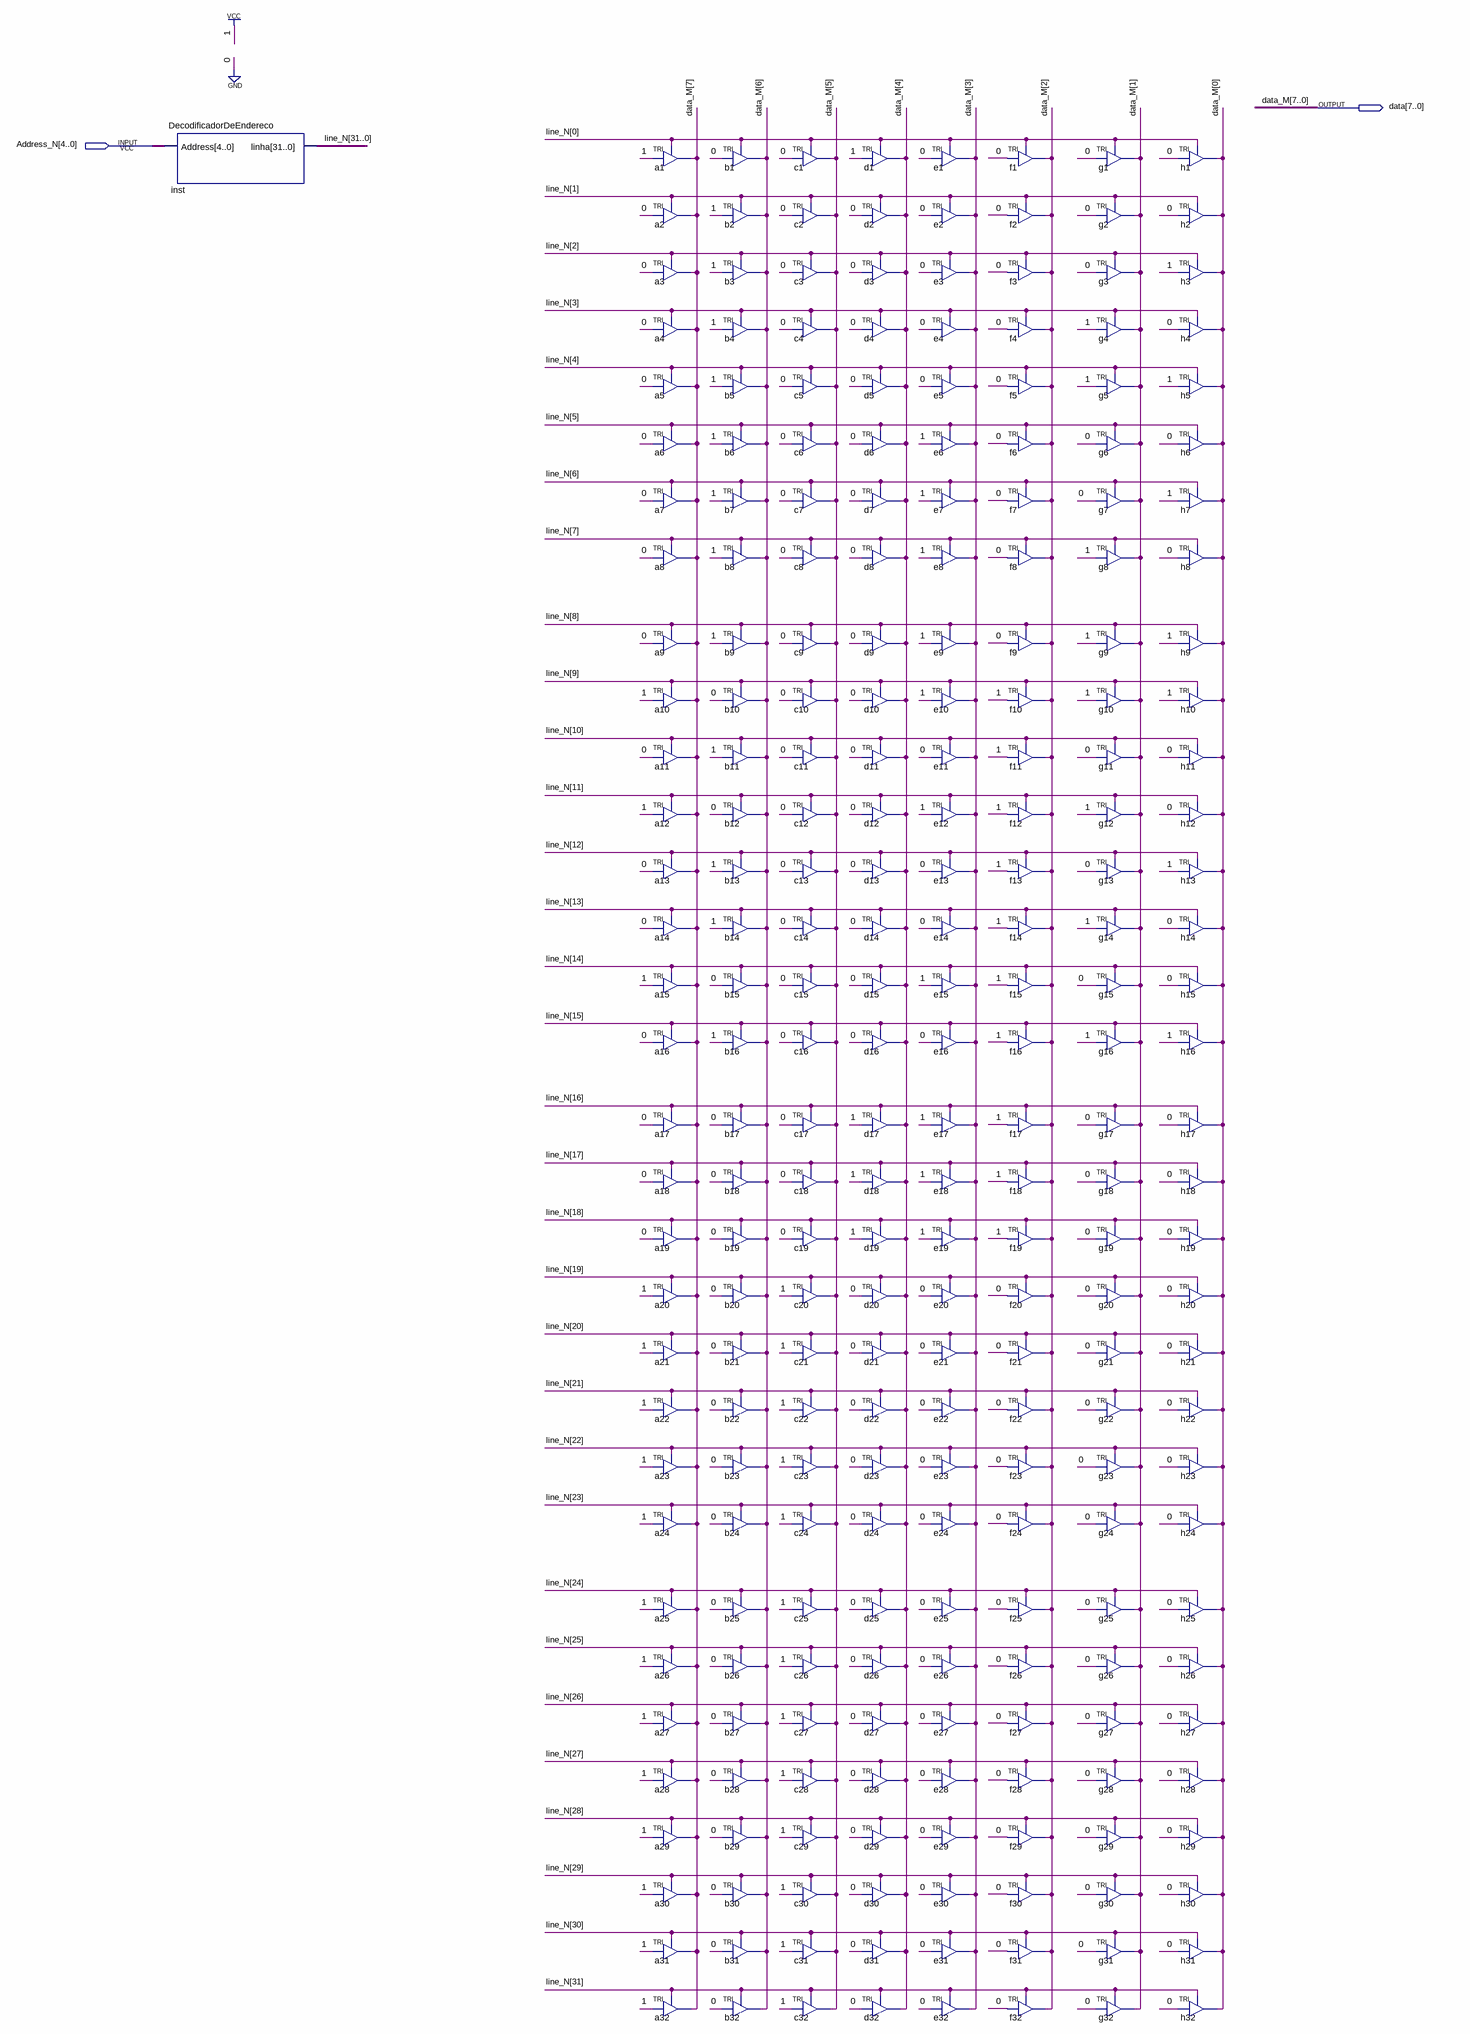
[diagram p0: schematic sheet]
// Quartus schematic PreparacaoProgramaFEEC.bdf as structural Verilog: 257 symbols, 2 pins
module PreparacaoProgramaFEEC (
  input  [4:0] Address_N,
  output [7:0] data
);

  wire [31:0] line_N;

  DecodificadorDeEndereco inst (.Address(Address_N), .linha(line_N));
  TRI a1 (.IN(1'b1), .OE(line_N[0]), .OUT(data[7]));
  TRI a2 (.IN(1'b0), .OE(line_N[1]), .OUT(data[7]));
  TRI a3 (.IN(1'b0), .OE(line_N[2]), .OUT(data[7]));
  TRI a4 (.IN(1'b0), .OE(line_N[3]), .OUT(data[7]));
  TRI a5 (.IN(1'b0), .OE(line_N[4]), .OUT(data[7]));
  TRI a6 (.IN(1'b0), .OE(line_N[5]), .OUT(data[7]));
  TRI a7 (.IN(1'b0), .OE(line_N[6]), .OUT(data[7]));
  TRI a8 (.IN(1'b0), .OE(line_N[7]), .OUT(data[7]));
  TRI a9 (.IN(1'b0), .OE(line_N[8]), .OUT(data[7]));
  TRI a10 (.IN(1'b1), .OE(line_N[9]), .OUT(data[7]));
  TRI a11 (.IN(1'b0), .OE(line_N[10]), .OUT(data[7]));
  TRI a12 (.IN(1'b1), .OE(line_N[11]), .OUT(data[7]));
  TRI a13 (.IN(1'b0), .OE(line_N[12]), .OUT(data[7]));
  TRI a14 (.IN(1'b0), .OE(line_N[13]), .OUT(data[7]));
  TRI a15 (.IN(1'b1), .OE(line_N[14]), .OUT(data[7]));
  TRI a16 (.IN(1'b0), .OE(line_N[15]), .OUT(data[7]));
  TRI a17 (.IN(1'b0), .OE(line_N[16]), .OUT(data[7]));
  TRI a18 (.IN(1'b0), .OE(line_N[17]), .OUT(data[7]));
  TRI a19 (.IN(1'b0), .OE(line_N[18]), .OUT(data[7]));
  TRI a20 (.IN(1'b1), .OE(line_N[19]), .OUT(data[7]));
  TRI a21 (.IN(1'b1), .OE(line_N[20]), .OUT(data[7]));
  TRI a22 (.IN(1'b1), .OE(line_N[21]), .OUT(data[7]));
  TRI a23 (.IN(1'b1), .OE(line_N[22]), .OUT(data[7]));
  TRI a24 (.IN(1'b1), .OE(line_N[23]), .OUT(data[7]));
  TRI a25 (.IN(1'b1), .OE(line_N[24]), .OUT(data[7]));
  TRI a26 (.IN(1'b1), .OE(line_N[25]), .OUT(data[7]));
  TRI a27 (.IN(1'b1), .OE(line_N[26]), .OUT(data[7]));
  TRI a28 (.IN(1'b1), .OE(line_N[27]), .OUT(data[7]));
  TRI a29 (.IN(1'b1), .OE(line_N[28]), .OUT(data[7]));
  TRI a30 (.IN(1'b1), .OE(line_N[29]), .OUT(data[7]));
  TRI a31 (.IN(1'b1), .OE(line_N[30]), .OUT(data[7]));
  TRI a32 (.IN(1'b1), .OE(line_N[31]), .OUT(data[7]));
  TRI b1 (.IN(1'b0), .OE(line_N[0]), .OUT(data[6]));
  TRI b2 (.IN(1'b1), .OE(line_N[1]), .OUT(data[6]));
  TRI b3 (.IN(1'b1), .OE(line_N[2]), .OUT(data[6]));
  TRI b4 (.IN(1'b1), .OE(line_N[3]), .OUT(data[6]));
  TRI b5 (.IN(1'b1), .OE(line_N[4]), .OUT(data[6]));
  TRI b6 (.IN(1'b1), .OE(line_N[5]), .OUT(data[6]));
  TRI b7 (.IN(1'b1), .OE(line_N[6]), .OUT(data[6]));
  TRI b8 (.IN(1'b1), .OE(line_N[7]), .OUT(data[6]));
  TRI b9 (.IN(1'b1), .OE(line_N[8]), .OUT(data[6]));
  TRI b10 (.IN(1'b0), .OE(line_N[9]), .OUT(data[6]));
  TRI b11 (.IN(1'b1), .OE(line_N[10]), .OUT(data[6]));
  TRI b12 (.IN(1'b0), .OE(line_N[11]), .OUT(data[6]));
  TRI b13 (.IN(1'b1), .OE(line_N[12]), .OUT(data[6]));
  TRI b14 (.IN(1'b1), .OE(line_N[13]), .OUT(data[6]));
  TRI b15 (.IN(1'b0), .OE(line_N[14]), .OUT(data[6]));
  TRI b16 (.IN(1'b1), .OE(line_N[15]), .OUT(data[6]));
  TRI b17 (.IN(1'b0), .OE(line_N[16]), .OUT(data[6]));
  TRI b18 (.IN(1'b0), .OE(line_N[17]), .OUT(data[6]));
  TRI b19 (.IN(1'b0), .OE(line_N[18]), .OUT(data[6]));
  TRI b20 (.IN(1'b0), .OE(line_N[19]), .OUT(data[6]));
  TRI b21 (.IN(1'b0), .OE(line_N[20]), .OUT(data[6]));
  TRI b22 (.IN(1'b0), .OE(line_N[21]), .OUT(data[6]));
  TRI b23 (.IN(1'b0), .OE(line_N[22]), .OUT(data[6]));
  TRI b24 (.IN(1'b0), .OE(line_N[23]), .OUT(data[6]));
  TRI b25 (.IN(1'b0), .OE(line_N[24]), .OUT(data[6]));
  TRI b26 (.IN(1'b0), .OE(line_N[25]), .OUT(data[6]));
  TRI b27 (.IN(1'b0), .OE(line_N[26]), .OUT(data[6]));
  TRI b28 (.IN(1'b0), .OE(line_N[27]), .OUT(data[6]));
  TRI b29 (.IN(1'b0), .OE(line_N[28]), .OUT(data[6]));
  TRI b30 (.IN(1'b0), .OE(line_N[29]), .OUT(data[6]));
  TRI b31 (.IN(1'b0), .OE(line_N[30]), .OUT(data[6]));
  TRI b32 (.IN(1'b0), .OE(line_N[31]), .OUT(data[6]));
  TRI c1 (.IN(1'b0), .OE(line_N[0]), .OUT(data[5]));
  TRI c2 (.IN(1'b0), .OE(line_N[1]), .OUT(data[5]));
  TRI c3 (.IN(1'b0), .OE(line_N[2]), .OUT(data[5]));
  TRI c4 (.IN(1'b0), .OE(line_N[3]), .OUT(data[5]));
  TRI c5 (.IN(1'b0), .OE(line_N[4]), .OUT(data[5]));
  TRI c6 (.IN(1'b0), .OE(line_N[5]), .OUT(data[5]));
  TRI c7 (.IN(1'b0), .OE(line_N[6]), .OUT(data[5]));
  TRI c8 (.IN(1'b0), .OE(line_N[7]), .OUT(data[5]));
  TRI c9 (.IN(1'b0), .OE(line_N[8]), .OUT(data[5]));
  TRI c10 (.IN(1'b0), .OE(line_N[9]), .OUT(data[5]));
  TRI c11 (.IN(1'b0), .OE(line_N[10]), .OUT(data[5]));
  TRI c12 (.IN(1'b0), .OE(line_N[11]), .OUT(data[5]));
  TRI c13 (.IN(1'b0), .OE(line_N[12]), .OUT(data[5]));
  TRI c14 (.IN(1'b0), .OE(line_N[13]), .OUT(data[5]));
  TRI c15 (.IN(1'b0), .OE(line_N[14]), .OUT(data[5]));
  TRI c16 (.IN(1'b0), .OE(line_N[15]), .OUT(data[5]));
  TRI c17 (.IN(1'b0), .OE(line_N[16]), .OUT(data[5]));
  TRI c18 (.IN(1'b0), .OE(line_N[17]), .OUT(data[5]));
  TRI c19 (.IN(1'b0), .OE(line_N[18]), .OUT(data[5]));
  TRI c20 (.IN(1'b1), .OE(line_N[19]), .OUT(data[5]));
  TRI c21 (.IN(1'b1), .OE(line_N[20]), .OUT(data[5]));
  TRI c22 (.IN(1'b1), .OE(line_N[21]), .OUT(data[5]));
  TRI c23 (.IN(1'b1), .OE(line_N[22]), .OUT(data[5]));
  TRI c24 (.IN(1'b1), .OE(line_N[23]), .OUT(data[5]));
  TRI c25 (.IN(1'b1), .OE(line_N[24]), .OUT(data[5]));
  TRI c26 (.IN(1'b1), .OE(line_N[25]), .OUT(data[5]));
  TRI c27 (.IN(1'b1), .OE(line_N[26]), .OUT(data[5]));
  TRI c28 (.IN(1'b1), .OE(line_N[27]), .OUT(data[5]));
  TRI c29 (.IN(1'b1), .OE(line_N[28]), .OUT(data[5]));
  TRI c30 (.IN(1'b1), .OE(line_N[29]), .OUT(data[5]));
  TRI c31 (.IN(1'b1), .OE(line_N[30]), .OUT(data[5]));
  TRI c32 (.IN(1'b1), .OE(line_N[31]), .OUT(data[5]));
  TRI d1 (.IN(1'b1), .OE(line_N[0]), .OUT(data[4]));
  TRI d2 (.IN(1'b0), .OE(line_N[1]), .OUT(data[4]));
  TRI d3 (.IN(1'b0), .OE(line_N[2]), .OUT(data[4]));
  TRI d4 (.IN(1'b0), .OE(line_N[3]), .OUT(data[4]));
  TRI d5 (.IN(1'b0), .OE(line_N[4]), .OUT(data[4]));
  TRI d6 (.IN(1'b0), .OE(line_N[5]), .OUT(data[4]));
  TRI d7 (.IN(1'b0), .OE(line_N[6]), .OUT(data[4]));
  TRI d8 (.IN(1'b0), .OE(line_N[7]), .OUT(data[4]));
  TRI d9 (.IN(1'b0), .OE(line_N[8]), .OUT(data[4]));
  TRI d10 (.IN(1'b0), .OE(line_N[9]), .OUT(data[4]));
  TRI d11 (.IN(1'b0), .OE(line_N[10]), .OUT(data[4]));
  TRI d12 (.IN(1'b0), .OE(line_N[11]), .OUT(data[4]));
  TRI d13 (.IN(1'b0), .OE(line_N[12]), .OUT(data[4]));
  TRI d14 (.IN(1'b0), .OE(line_N[13]), .OUT(data[4]));
  TRI d15 (.IN(1'b0), .OE(line_N[14]), .OUT(data[4]));
  TRI d16 (.IN(1'b0), .OE(line_N[15]), .OUT(data[4]));
  TRI d17 (.IN(1'b1), .OE(line_N[16]), .OUT(data[4]));
  TRI d18 (.IN(1'b1), .OE(line_N[17]), .OUT(data[4]));
  TRI d19 (.IN(1'b1), .OE(line_N[18]), .OUT(data[4]));
  TRI d20 (.IN(1'b0), .OE(line_N[19]), .OUT(data[4]));
  TRI d21 (.IN(1'b0), .OE(line_N[20]), .OUT(data[4]));
  TRI d22 (.IN(1'b0), .OE(line_N[21]), .OUT(data[4]));
  TRI d23 (.IN(1'b0), .OE(line_N[22]), .OUT(data[4]));
  TRI d24 (.IN(1'b0), .OE(line_N[23]), .OUT(data[4]));
  TRI d25 (.IN(1'b0), .OE(line_N[24]), .OUT(data[4]));
  TRI d26 (.IN(1'b0), .OE(line_N[25]), .OUT(data[4]));
  TRI d27 (.IN(1'b0), .OE(line_N[26]), .OUT(data[4]));
  TRI d28 (.IN(1'b0), .OE(line_N[27]), .OUT(data[4]));
  TRI d29 (.IN(1'b0), .OE(line_N[28]), .OUT(data[4]));
  TRI d30 (.IN(1'b0), .OE(line_N[29]), .OUT(data[4]));
  TRI d31 (.IN(1'b0), .OE(line_N[30]), .OUT(data[4]));
  TRI d32 (.IN(1'b0), .OE(line_N[31]), .OUT(data[4]));
  TRI e1 (.IN(1'b0), .OE(line_N[0]), .OUT(data[3]));
  TRI e2 (.IN(1'b0), .OE(line_N[1]), .OUT(data[3]));
  TRI e3 (.IN(1'b0), .OE(line_N[2]), .OUT(data[3]));
  TRI e4 (.IN(1'b0), .OE(line_N[3]), .OUT(data[3]));
  TRI e5 (.IN(1'b0), .OE(line_N[4]), .OUT(data[3]));
  TRI e6 (.IN(1'b1), .OE(line_N[5]), .OUT(data[3]));
  TRI e7 (.IN(1'b1), .OE(line_N[6]), .OUT(data[3]));
  TRI e8 (.IN(1'b1), .OE(line_N[7]), .OUT(data[3]));
  TRI e9 (.IN(1'b1), .OE(line_N[8]), .OUT(data[3]));
  TRI e10 (.IN(1'b1), .OE(line_N[9]), .OUT(data[3]));
  TRI e11 (.IN(1'b0), .OE(line_N[10]), .OUT(data[3]));
  TRI e12 (.IN(1'b1), .OE(line_N[11]), .OUT(data[3]));
  TRI e13 (.IN(1'b0), .OE(line_N[12]), .OUT(data[3]));
  TRI e14 (.IN(1'b0), .OE(line_N[13]), .OUT(data[3]));
  TRI e15 (.IN(1'b1), .OE(line_N[14]), .OUT(data[3]));
  TRI e16 (.IN(1'b0), .OE(line_N[15]), .OUT(data[3]));
  TRI e17 (.IN(1'b1), .OE(line_N[16]), .OUT(data[3]));
  TRI e18 (.IN(1'b1), .OE(line_N[17]), .OUT(data[3]));
  TRI e19 (.IN(1'b1), .OE(line_N[18]), .OUT(data[3]));
  TRI e20 (.IN(1'b0), .OE(line_N[19]), .OUT(data[3]));
  TRI e21 (.IN(1'b0), .OE(line_N[20]), .OUT(data[3]));
  TRI e22 (.IN(1'b0), .OE(line_N[21]), .OUT(data[3]));
  TRI e23 (.IN(1'b0), .OE(line_N[22]), .OUT(data[3]));
  TRI e24 (.IN(1'b0), .OE(line_N[23]), .OUT(data[3]));
  TRI e25 (.IN(1'b0), .OE(line_N[24]), .OUT(data[3]));
  TRI e26 (.IN(1'b0), .OE(line_N[25]), .OUT(data[3]));
  TRI e27 (.IN(1'b0), .OE(line_N[26]), .OUT(data[3]));
  TRI e28 (.IN(1'b0), .OE(line_N[27]), .OUT(data[3]));
  TRI e29 (.IN(1'b0), .OE(line_N[28]), .OUT(data[3]));
  TRI e30 (.IN(1'b0), .OE(line_N[29]), .OUT(data[3]));
  TRI e31 (.IN(1'b0), .OE(line_N[30]), .OUT(data[3]));
  TRI e32 (.IN(1'b0), .OE(line_N[31]), .OUT(data[3]));
  TRI f1 (.IN(1'b0), .OE(line_N[0]), .OUT(data[2]));
  TRI f2 (.IN(1'b0), .OE(line_N[1]), .OUT(data[2]));
  TRI f3 (.IN(1'b0), .OE(line_N[2]), .OUT(data[2]));
  TRI f4 (.IN(1'b0), .OE(line_N[3]), .OUT(data[2]));
  TRI f5 (.IN(1'b0), .OE(line_N[4]), .OUT(data[2]));
  TRI f6 (.IN(1'b0), .OE(line_N[5]), .OUT(data[2]));
  TRI f7 (.IN(1'b0), .OE(line_N[6]), .OUT(data[2]));
  TRI f8 (.IN(1'b0), .OE(line_N[7]), .OUT(data[2]));
  TRI f9 (.IN(1'b0), .OE(line_N[8]), .OUT(data[2]));
  TRI f10 (.IN(1'b1), .OE(line_N[9]), .OUT(data[2]));
  TRI f11 (.IN(1'b1), .OE(line_N[10]), .OUT(data[2]));
  TRI f12 (.IN(1'b1), .OE(line_N[11]), .OUT(data[2]));
  TRI f13 (.IN(1'b1), .OE(line_N[12]), .OUT(data[2]));
  TRI f14 (.IN(1'b1), .OE(line_N[13]), .OUT(data[2]));
  TRI f15 (.IN(1'b1), .OE(line_N[14]), .OUT(data[2]));
  TRI f16 (.IN(1'b1), .OE(line_N[15]), .OUT(data[2]));
  TRI f17 (.IN(1'b1), .OE(line_N[16]), .OUT(data[2]));
  TRI f18 (.IN(1'b1), .OE(line_N[17]), .OUT(data[2]));
  TRI f19 (.IN(1'b1), .OE(line_N[18]), .OUT(data[2]));
  TRI f20 (.IN(1'b0), .OE(line_N[19]), .OUT(data[2]));
  TRI f21 (.IN(1'b0), .OE(line_N[20]), .OUT(data[2]));
  TRI f22 (.IN(1'b0), .OE(line_N[21]), .OUT(data[2]));
  TRI f23 (.IN(1'b0), .OE(line_N[22]), .OUT(data[2]));
  TRI f24 (.IN(1'b0), .OE(line_N[23]), .OUT(data[2]));
  TRI f25 (.IN(1'b0), .OE(line_N[24]), .OUT(data[2]));
  TRI f26 (.IN(1'b0), .OE(line_N[25]), .OUT(data[2]));
  TRI f27 (.IN(1'b0), .OE(line_N[26]), .OUT(data[2]));
  TRI f28 (.IN(1'b0), .OE(line_N[27]), .OUT(data[2]));
  TRI f29 (.IN(1'b0), .OE(line_N[28]), .OUT(data[2]));
  TRI f30 (.IN(1'b0), .OE(line_N[29]), .OUT(data[2]));
  TRI f31 (.IN(1'b0), .OE(line_N[30]), .OUT(data[2]));
  TRI f32 (.IN(1'b0), .OE(line_N[31]), .OUT(data[2]));
  TRI g1 (.IN(1'b0), .OE(line_N[0]), .OUT(data[1]));
  TRI g2 (.IN(1'b0), .OE(line_N[1]), .OUT(data[1]));
  TRI g3 (.IN(1'b0), .OE(line_N[2]), .OUT(data[1]));
  TRI g4 (.IN(1'b1), .OE(line_N[3]), .OUT(data[1]));
  TRI g5 (.IN(1'b1), .OE(line_N[4]), .OUT(data[1]));
  TRI g6 (.IN(1'b0), .OE(line_N[5]), .OUT(data[1]));
  TRI g7 (.IN(1'b0), .OE(line_N[6]), .OUT(data[1]));
  TRI g8 (.IN(1'b1), .OE(line_N[7]), .OUT(data[1]));
  TRI g9 (.IN(1'b1), .OE(line_N[8]), .OUT(data[1]));
  TRI g10 (.IN(1'b1), .OE(line_N[9]), .OUT(data[1]));
  TRI g11 (.IN(1'b0), .OE(line_N[10]), .OUT(data[1]));
  TRI g12 (.IN(1'b1), .OE(line_N[11]), .OUT(data[1]));
  TRI g13 (.IN(1'b0), .OE(line_N[12]), .OUT(data[1]));
  TRI g14 (.IN(1'b1), .OE(line_N[13]), .OUT(data[1]));
  TRI g15 (.IN(1'b0), .OE(line_N[14]), .OUT(data[1]));
  TRI g16 (.IN(1'b1), .OE(line_N[15]), .OUT(data[1]));
  TRI g17 (.IN(1'b0), .OE(line_N[16]), .OUT(data[1]));
  TRI g18 (.IN(1'b0), .OE(line_N[17]), .OUT(data[1]));
  TRI g19 (.IN(1'b0), .OE(line_N[18]), .OUT(data[1]));
  TRI g20 (.IN(1'b0), .OE(line_N[19]), .OUT(data[1]));
  TRI g21 (.IN(1'b0), .OE(line_N[20]), .OUT(data[1]));
  TRI g22 (.IN(1'b0), .OE(line_N[21]), .OUT(data[1]));
  TRI g23 (.IN(1'b0), .OE(line_N[22]), .OUT(data[1]));
  TRI g24 (.IN(1'b0), .OE(line_N[23]), .OUT(data[1]));
  TRI g25 (.IN(1'b0), .OE(line_N[24]), .OUT(data[1]));
  TRI g26 (.IN(1'b0), .OE(line_N[25]), .OUT(data[1]));
  TRI g27 (.IN(1'b0), .OE(line_N[26]), .OUT(data[1]));
  TRI g28 (.IN(1'b0), .OE(line_N[27]), .OUT(data[1]));
  TRI g29 (.IN(1'b0), .OE(line_N[28]), .OUT(data[1]));
  TRI g30 (.IN(1'b0), .OE(line_N[29]), .OUT(data[1]));
  TRI g31 (.IN(1'b0), .OE(line_N[30]), .OUT(data[1]));
  TRI g32 (.IN(1'b0), .OE(line_N[31]), .OUT(data[1]));
  TRI h1 (.IN(1'b0), .OE(line_N[0]), .OUT(data[0]));
  TRI h2 (.IN(1'b0), .OE(line_N[1]), .OUT(data[0]));
  TRI h3 (.IN(1'b1), .OE(line_N[2]), .OUT(data[0]));
  TRI h4 (.IN(1'b0), .OE(line_N[3]), .OUT(data[0]));
  TRI h5 (.IN(1'b1), .OE(line_N[4]), .OUT(data[0]));
  TRI h6 (.IN(1'b0), .OE(line_N[5]), .OUT(data[0]));
  TRI h7 (.IN(1'b1), .OE(line_N[6]), .OUT(data[0]));
  TRI h8 (.IN(1'b0), .OE(line_N[7]), .OUT(data[0]));
  TRI h9 (.IN(1'b1), .OE(line_N[8]), .OUT(data[0]));
  TRI h10 (.IN(1'b1), .OE(line_N[9]), .OUT(data[0]));
  TRI h11 (.IN(1'b0), .OE(line_N[10]), .OUT(data[0]));
  TRI h12 (.IN(1'b0), .OE(line_N[11]), .OUT(data[0]));
  TRI h13 (.IN(1'b1), .OE(line_N[12]), .OUT(data[0]));
  TRI h14 (.IN(1'b0), .OE(line_N[13]), .OUT(data[0]));
  TRI h15 (.IN(1'b0), .OE(line_N[14]), .OUT(data[0]));
  TRI h16 (.IN(1'b1), .OE(line_N[15]), .OUT(data[0]));
  TRI h17 (.IN(1'b0), .OE(line_N[16]), .OUT(data[0]));
  TRI h18 (.IN(1'b0), .OE(line_N[17]), .OUT(data[0]));
  TRI h19 (.IN(1'b0), .OE(line_N[18]), .OUT(data[0]));
  TRI h20 (.IN(1'b0), .OE(line_N[19]), .OUT(data[0]));
  TRI h21 (.IN(1'b0), .OE(line_N[20]), .OUT(data[0]));
  TRI h22 (.IN(1'b0), .OE(line_N[21]), .OUT(data[0]));
  TRI h23 (.IN(1'b0), .OE(line_N[22]), .OUT(data[0]));
  TRI h24 (.IN(1'b0), .OE(line_N[23]), .OUT(data[0]));
  TRI h25 (.IN(1'b0), .OE(line_N[24]), .OUT(data[0]));
  TRI h26 (.IN(1'b0), .OE(line_N[25]), .OUT(data[0]));
  TRI h27 (.IN(1'b0), .OE(line_N[26]), .OUT(data[0]));
  TRI h28 (.IN(1'b0), .OE(line_N[27]), .OUT(data[0]));
  TRI h29 (.IN(1'b0), .OE(line_N[28]), .OUT(data[0]));
  TRI h30 (.IN(1'b0), .OE(line_N[29]), .OUT(data[0]));
  TRI h31 (.IN(1'b0), .OE(line_N[30]), .OUT(data[0]));
  TRI h32 (.IN(1'b0), .OE(line_N[31]), .OUT(data[0]));

  // Other names for the same wires on the sheet: data_M[7:0] = data
endmodule
